# EAGLE schematic MPU6000 (EAGLE 7.5.0)
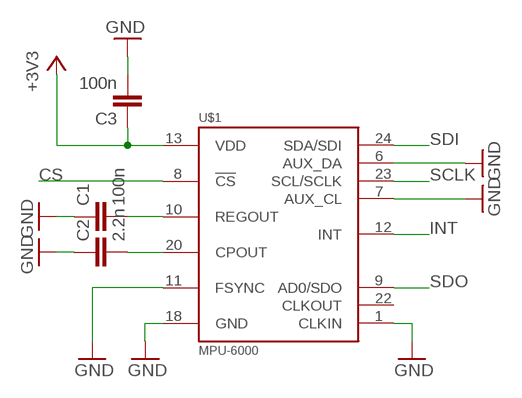
[diagram p0: schematic, sheet 1]

## Parts
C1  100n  C-EUC0805  [C0805]
C2  2.2n  C-EUC0805  [C0805]
C3  100n  C-EUC0805  [C0805]
U$1  MPU-6000  [QFN-24]

## Nets
+3V3: C3.1 U$1.13(VDD)
CS: U$1.8(!CS)
GND: C1.1 C2.1 C3.2 U$1.1(CLKIN) U$1.6(AUX_DA) U$1.7(AUX_CL) U$1.11(FSYNC) U$1.18(GND)
INT: U$1.12(INT)
N$2: C1.2 U$1.10(REGOUT)
N$3: C2.2 U$1.20(CPOUT)
SCLK: U$1.23(SCL/SCLK)
SDI: U$1.24(SDA/SDI)
SDO: U$1.9(AD0/SDO)
Unconnected: U$1.22(CLKOUT)

## Library data of the parts
C1-C3 = rcl:C-EU: CAPACITOR, European symbol
U$1 = MPU-6000:MPU-6000: ITG-3200 3-axis gyro, digital output, qfn24 package; AVAILABILITY: Good; DESCRIPTION: 3-axis gyroscope, 3-axis accelerometer in a 4x4x0.9 housing; MF: InvenSense; MP: MPU-6000; PACKAGE: QFN-24 InvenSense; PRICE: 7.23 USD